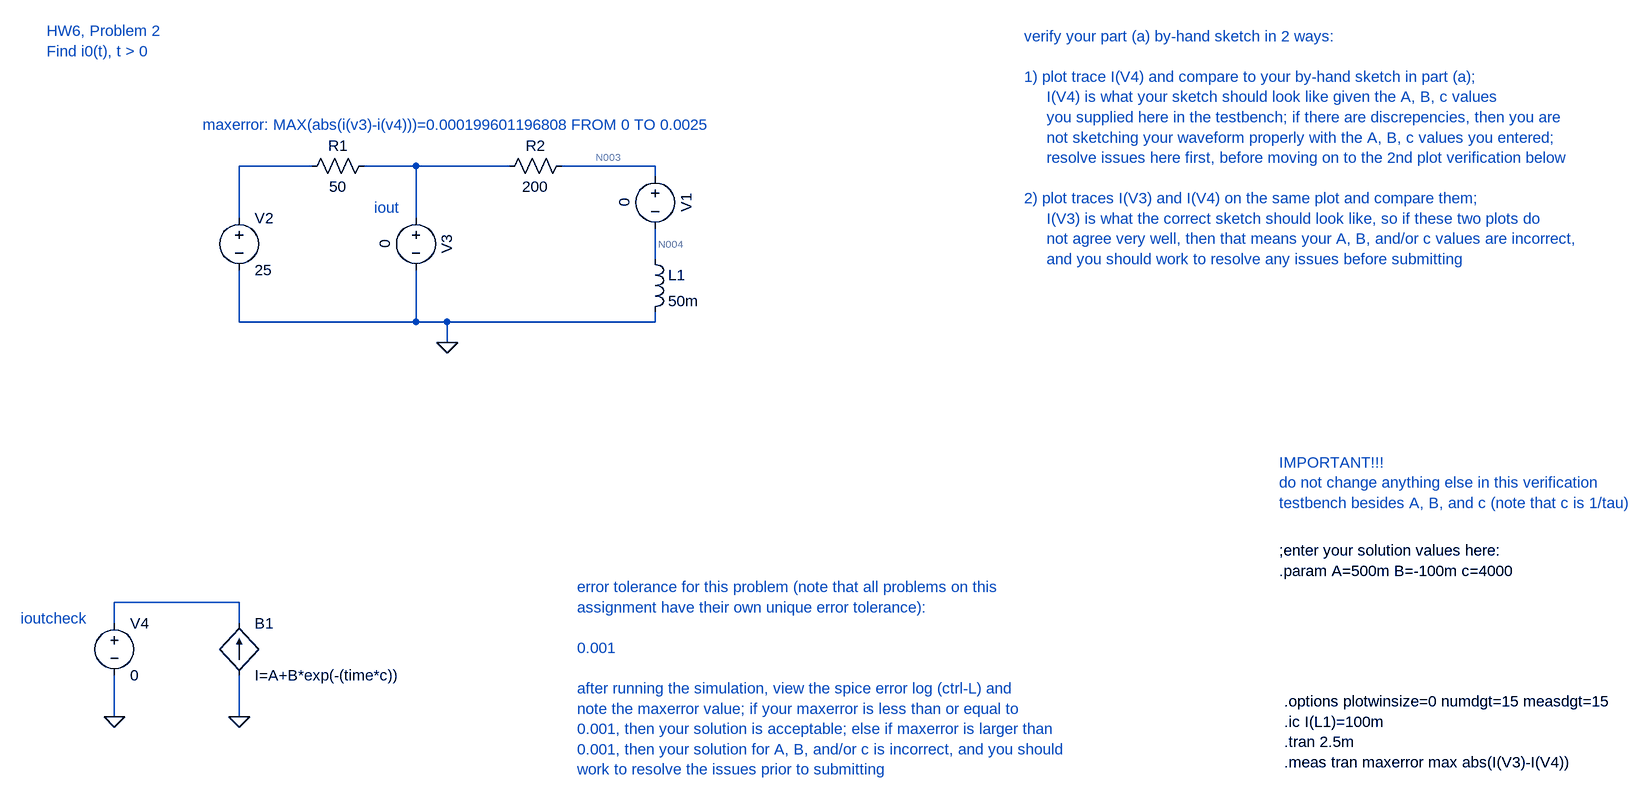
[diagram p0: schematic hw6_prob2.asc]
hw6_prob2.asc, the LTspice schematic file:
Version 4
SHEET 1 1520 1140
WIRE -560 -272 -672 -272
WIRE -400 -272 -480 -272
WIRE -256 -272 -400 -272
WIRE -32 -272 -176 -272
WIRE -32 -256 -32 -272
WIRE -672 -192 -672 -272
WIRE -400 -192 -400 -272
WIRE -32 -128 -32 -176
WIRE -672 -32 -672 -112
WIRE -400 -32 -400 -112
WIRE -400 -32 -672 -32
WIRE -352 -32 -400 -32
WIRE -32 -32 -32 -48
WIRE -32 -32 -352 -32
WIRE -352 0 -352 -32
WIRE -672 400 -864 400
WIRE -864 432 -864 400
WIRE -672 432 -672 400
WIRE -864 576 -864 512
WIRE -672 576 -672 512
FLAG -352 0 0
FLAG -672 576 0
FLAG -864 576 0
SYMBOL ind -48 -144 R0
SYMATTR SpiceLine Rser=0
SYMATTR InstName L1
SYMATTR Value 50m
SYMBOL res -272 -256 R270
WINDOW 0 32 56 VTop 2
WINDOW 3 0 56 VBottom 2
SYMATTR InstName R2
SYMATTR Value 200
SYMBOL res -464 -288 R90
WINDOW 0 0 56 VBottom 2
WINDOW 3 32 56 VTop 2
SYMATTR InstName R1
SYMATTR Value 50
SYMBOL voltage -32 -272 R0
WINDOW 0 32 56 VTop 2
WINDOW 3 -32 56 VBottom 2
WINDOW 123 0 0 Left 0
WINDOW 39 0 0 Left 0
SYMATTR InstName V1
SYMATTR Value 0
SYMBOL voltage -672 -208 R0
WINDOW 123 0 0 Left 0
WINDOW 39 0 0 Left 0
SYMATTR InstName V2
SYMATTR Value 25
SYMBOL voltage -400 -208 R0
WINDOW 0 32 56 VTop 2
WINDOW 3 -32 56 VBottom 2
WINDOW 123 0 0 Left 0
WINDOW 39 0 0 Left 0
SYMATTR InstName V3
SYMATTR Value 0
SYMBOL bi -672 512 M180
WINDOW 0 24 80 Left 2
WINDOW 3 24 0 Left 2
SYMATTR InstName B1
SYMATTR Value I=A+B*exp(-(time*c))
SYMBOL voltage -864 416 R0
WINDOW 123 0 0 Left 0
WINDOW 39 0 0 Left 0
SYMATTR InstName V4
SYMATTR Value 0
TEXT 936 552 Left 2 !.options plotwinsize=0 numdgt=15 measdgt=15\n.ic I(L1)=100m\n.tran 2.5m\n.meas tran maxerror max abs(I(V3)-I(V4))
TEXT -968 -480 Left 2 ;HW6, Problem 2\nFind i0(t), t > 0
TEXT -464 -208 Left 2 ;iout
TEXT 928 320 Left 2 !;enter your solution values here:\n.param A=500m B=-100m c=4000
TEXT 928 184 Left 2 ;IMPORTANT!!!\ndo not change anything else in this verification\ntestbench besides A, B, and c (note that c is 1/tau)
TEXT -152 376 Left 2 ;error tolerance for this problem (note that all problems on this \nassignment have their own unique error tolerance):\n \n0.001\n \nafter running the simulation, view the spice error log (ctrl-L) and \nnote the maxerror value; if your maxerror is less than or equal to\n0.001, then your solution is acceptable; else if maxerror is larger than\n0.001, then your solution for A, B, and/or c is incorrect, and you should \nwork to resolve the issues prior to submitting
TEXT -1008 424 Left 2 ;ioutcheck
TEXT 536 -472 Left 2 ;verify your part (a) by-hand sketch in 2 ways:\n \n1) plot trace I(V4) and compare to your by-hand sketch in part (a);\n     I(V4) is what your sketch should look like given the A, B, c values \n     you supplied here in the testbench; if there are discrepencies, then you are\n     not sketching your waveform properly with the A, B, c values you entered;\n     resolve issues here first, before moving on to the 2nd plot verification below\n \n2) plot traces I(V3) and I(V4) on the same plot and compare them;\n     I(V3) is what the correct sketch should look like, so if these two plots do \n     not agree very well, then that means your A, B, and/or c values are incorrect,\n     and you should work to resolve any issues before submitting
TEXT -728 -336 Left 2 ;maxerror: MAX(abs(i(v3)-i(v4)))=0.000199601196808 FROM 0 TO 0.0025

The netlist it stands for:
* hw6_prob2.asc
L1 N004 0 50m Rser=0
R2 N002 N003 200
R1 N002 N001 50
V1 N003 N004 0
V2 N001 0 25
V3 N002 0 0
B1 0 N005 I=A+B*exp(-(time*c))
V4 N005 0 0
.options plotwinsize=0 numdgt=15 measdgt=15
.ic I(L1)=100m
.tran 2.5m
.meas tran maxerror max abs(I(V3)-I(V4))
* HW6, Problem 2
* Find i0(t), t > 0
* iout
;enter your solution values here:
.param A=500m B=-100m c=4000
* IMPORTANT!!!
* do not change anything else in this verification
* testbench besides A, B, and c (note that c is 1/tau)
* error tolerance for this problem (note that all problems on this
* assignment have their own unique error tolerance):
* 0.001
* after running the simulation, view the spice error log (ctrl-L) and
* note the maxerror value; if your maxerror is less than or equal to
* 0.001, then your solution is acceptable; else if maxerror is larger than
* 0.001, then your solution for A, B, and/or c is incorrect, and you should
* work to resolve the issues prior to submitting
* ioutcheck
* verify your part (a) by-hand sketch in 2 ways:
* 1) plot trace I(V4) and compare to your by-hand sketch in part (a);
*      I(V4) is what your sketch should look like given the A, B, c values
*      you supplied here in the testbench; if there are discrepencies, then you are
*      not sketching your waveform properly with the A, B, c values you entered;
*      resolve issues here first, before moving on to the 2nd plot verification below
* 2) plot traces I(V3) and I(V4) on the same plot and compare them;
*      I(V3) is what the correct sketch should look like, so if these two plots do
*      not agree very well, then that means your A, B, and/or c values are incorrect,
*      and you should work to resolve any issues before submitting
* maxerror: MAX(abs(i(v3)-i(v4)))=0.000199601196808 FROM 0 TO 0.0025
.backanno
.end

* Results of the author's LTspice run, read from the files saved beside the schematic
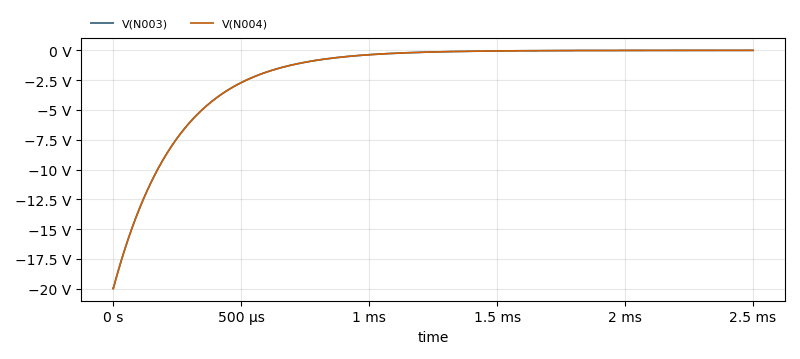
[diagram p1: Transient Analysis of hw6_prob2.asc, plotted from the saved traces]
* Transient Analysis, 1 run:
*   V(N003): min -20 V, max -907.9 µV, average -2 V, rms 4.472 V, last -907.9 µV
*   V(N004): min -20 V, max -907.9 µV, average -2 V, rms 4.472 V, last -907.9 µV
* From the log:
*   maxerror: MAX(abs(i(v3)-i(v4)))=0.000199601196808 FROM 0 TO 0.0025